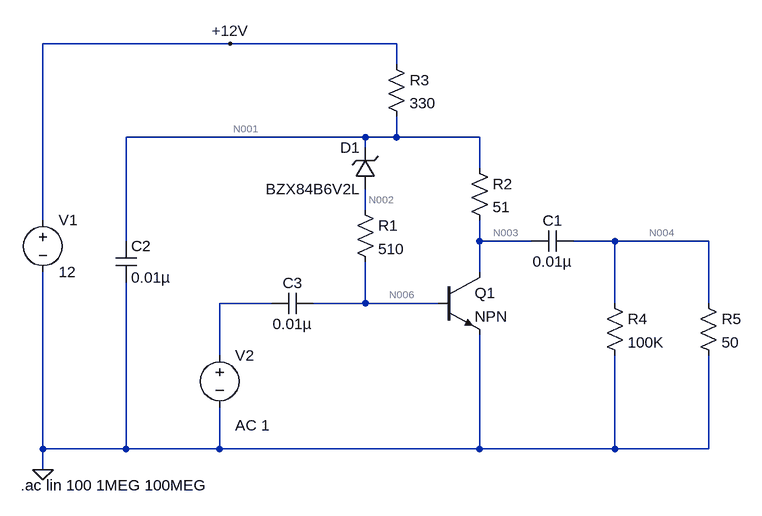
[diagram p0: schematic Design1.asc]
Design1.asc, the LTspice schematic file:
Version 4
SHEET 1 880 680
WIRE -112 -208 -400 -208
WIRE 144 -208 -112 -208
WIRE 144 -176 144 -208
WIRE 96 -64 -272 -64
WIRE 144 -64 144 -96
WIRE 144 -64 96 -64
WIRE 272 -64 144 -64
WIRE 96 -48 96 -64
WIRE 272 -16 272 -64
WIRE 96 48 96 16
WIRE -400 64 -400 -208
WIRE -272 96 -272 -64
WIRE 272 96 272 64
WIRE 352 96 272 96
WIRE 480 96 416 96
WIRE 624 96 480 96
WIRE 272 144 272 96
WIRE -48 192 -128 192
WIRE 96 192 96 128
WIRE 96 192 16 192
WIRE 208 192 96 192
WIRE 480 192 480 96
WIRE 624 192 624 96
WIRE -128 272 -128 192
WIRE -400 416 -400 144
WIRE -272 416 -272 160
WIRE -272 416 -400 416
WIRE -128 416 -128 352
WIRE -128 416 -272 416
WIRE 272 416 272 240
WIRE 272 416 -128 416
WIRE 480 416 480 272
WIRE 480 416 272 416
WIRE 624 416 624 272
WIRE 624 416 480 416
WIRE -400 448 -400 416
FLAG -400 448 0
FLAG -112 -208 +12V
SYMBOL res 80 32 R0
SYMATTR InstName R1
SYMATTR Value 510
SYMBOL res 256 -32 R0
SYMATTR InstName R2
SYMATTR Value 51
SYMBOL res 128 -192 R0
SYMATTR InstName R3
SYMATTR Value 330
SYMBOL npn 208 144 R0
SYMATTR InstName Q1
SYMBOL zener 112 16 R180
WINDOW 0 24 64 Left 2
WINDOW 3 24 0 Left 2
SYMATTR InstName D1
SYMATTR Value BZX84B6V2L
SYMATTR Description Diode
SYMATTR Type diode
SYMBOL cap 416 80 R90
WINDOW 0 0 32 VBottom 2
WINDOW 3 32 32 VTop 2
SYMATTR InstName C1
SYMATTR Value 0.01µ
SYMBOL res 464 176 R0
SYMATTR InstName R4
SYMATTR Value 100K
SYMBOL voltage -400 48 R0
SYMATTR InstName V1
SYMATTR Value 12
SYMBOL cap -288 96 R0
SYMATTR InstName C2
SYMATTR Value 0.01µ
SYMBOL voltage -128 256 R0
WINDOW 123 24 124 Left 2
WINDOW 39 0 0 Left 0
SYMATTR InstName V2
SYMATTR Value ""
SYMATTR Value2 AC 1
SYMBOL cap 16 176 R90
WINDOW 0 0 32 VBottom 2
WINDOW 3 32 32 VTop 2
SYMATTR InstName C3
SYMATTR Value 0.01µ
SYMBOL res 608 176 R0
SYMATTR InstName R5
SYMATTR Value 50
TEXT -434 472 Left 2 !.ac lin 100 1MEG 100MEG

The netlist it stands for:
* Design1.asc
R1 N002 N006 510
R2 N001 N003 51
R3 +12V N001 330
Q1 N003 N006 0 0 NPN
D1 N002 N001 BZX84B6V2L
C1 N004 N003 0.01µ
R4 N004 0 100K
V1 +12V 0 12
C2 N001 0 0.01µ
V2 N005 0 AC 1
C3 N006 N005 0.01µ
R5 N004 0 50
.model D D
.lib standard.dio
.model NPN NPN
.model PNP PNP
.lib standard.bjt
.ac lin 100 1MEG 100MEG
.backanno
.end

* Results of the author's LTspice run, read from the files saved beside the schematic
* Operating Point, zero values left out:
*   V(n002) = 919.3 mV
*   V(n006) = 843.9 mV
*   V(n001) = 7.072 V
*   V(n003) = 6.318 V
*   V(+12v) = 12 V
*   Ic(Q1) = 14.78 mA
*   Ib(Q1) = 147.8 µA
*   Ie(Q1) = -14.93 mA
*   I(D1) = -147.8 µA
*   I(R3) = 14.93 mA
*   I(R2) = 14.78 mA
*   I(R1) = 147.8 µA
*   I(V1) = -14.93 mA
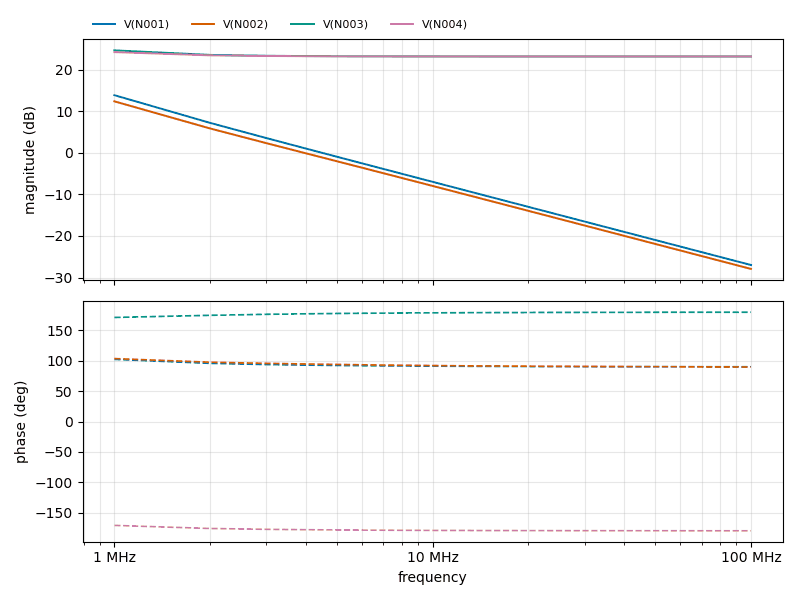
[diagram p1: AC Analysis of Design1.asc, plotted from the saved traces]
* AC Analysis, 1 run:
*   V(N001): 13.87 dB at 1 MHz, -26.99 dB at 100 MHz, peak 13.87 dB at 1 MHz, 3 dB below the peak at 1.367 MHz
*   V(N002): 12.39 dB at 1 MHz, -27.94 dB at 100 MHz, peak 12.39 dB at 1 MHz, 3 dB below the peak at 1.376 MHz
*   V(N003): 24.65 dB at 1 MHz, 23.18 dB at 100 MHz, peak 24.65 dB at 1 MHz
*   V(N004): 24.23 dB at 1 MHz, 23.18 dB at 100 MHz, peak 24.23 dB at 1 MHz